# EAGLE design BMS Enerdel Adapter rev4 (EAGLE 9.6.2)
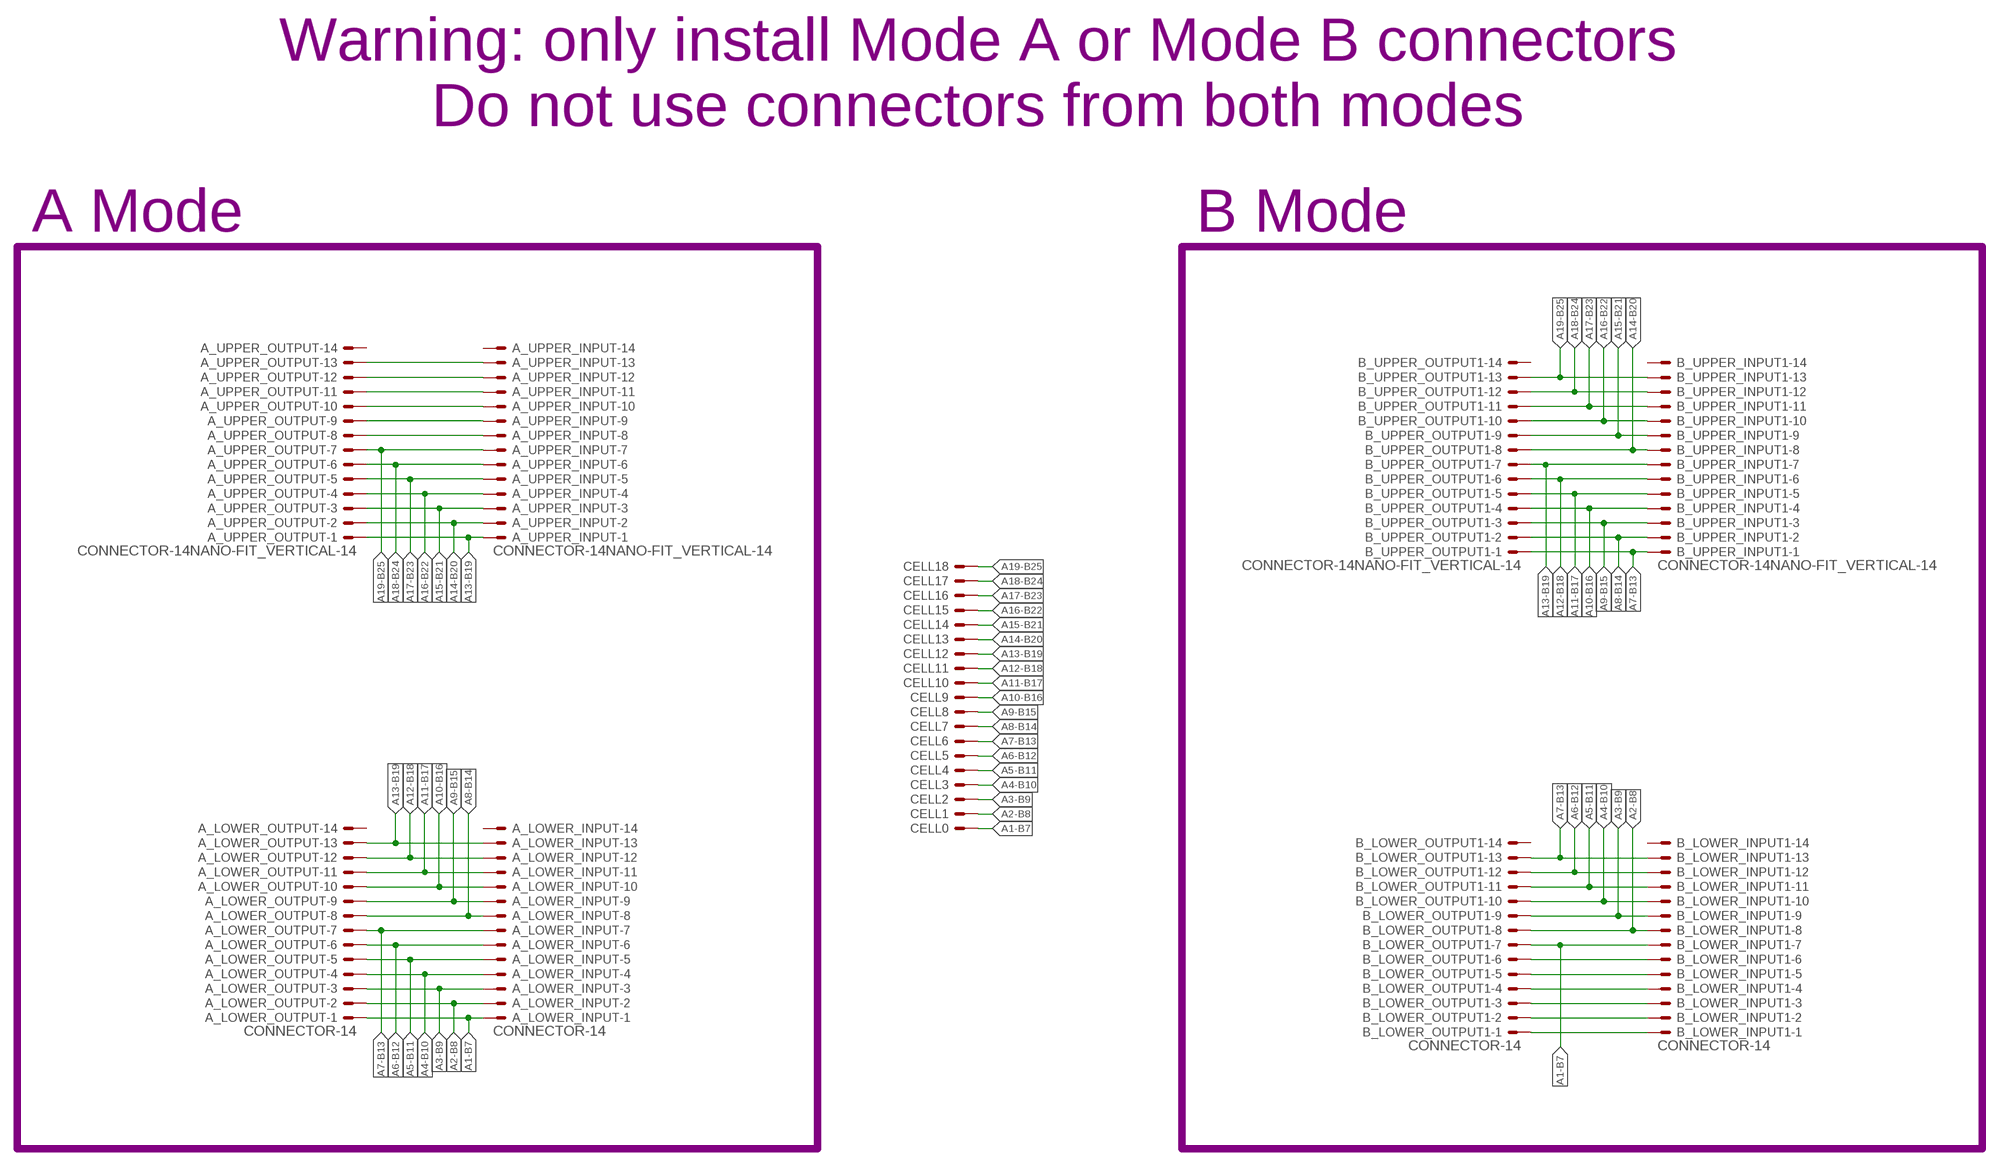
[diagram p0: schematic, sheet 1]

## Parts
A_LOWER_INPUT  CONNECTOR-14  [MINIFIT_5566-14]
A_LOWER_OUTPUT  CONNECTOR-14  [MINIFIT_5566-14]
A_UPPER_INPUT  CONNECTOR-14NANO-FIT_VERTICAL-14  [NANO-FIT_VERTICAL-14]
A_UPPER_OUTPUT  CONNECTOR-14NANO-FIT_VERTICAL-14  [NANO-FIT_VERTICAL-14]
B_LOWER_INPUT1  CONNECTOR-14  [MINIFIT_5566-14]
B_LOWER_OUTPUT1  CONNECTOR-14  [MINIFIT_5566-14]
B_UPPER_INPUT1  CONNECTOR-14NANO-FIT_VERTICAL-14  [NANO-FIT_VERTICAL-14]
B_UPPER_OUTPUT1  CONNECTOR-14NANO-FIT_VERTICAL-14  [NANO-FIT_VERTICAL-14]
CELL0  BATTERY_SPRING  [KEYSTONE5203]
CELL1  BATTERY_SPRING  [KEYSTONE5203]
CELL2  BATTERY_SPRING  [KEYSTONE5203]
CELL3  BATTERY_SPRING  [KEYSTONE5203]
CELL4  BATTERY_SPRING  [KEYSTONE5203]
CELL5  BATTERY_SPRING  [KEYSTONE5203]
CELL6  BATTERY_SPRING  [KEYSTONE5203]
CELL7  BATTERY_SPRING  [KEYSTONE5203]
CELL8  BATTERY_SPRING  [KEYSTONE5203]
CELL9  BATTERY_SPRING  [KEYSTONE5203]
CELL10  BATTERY_SPRING  [KEYSTONE5203]
CELL11  BATTERY_SPRING  [KEYSTONE5203]
CELL12  BATTERY_SPRING  [KEYSTONE5203]
CELL13  BATTERY_SPRING  [KEYSTONE5203]
CELL14  BATTERY_SPRING  [KEYSTONE5203]
CELL15  BATTERY_SPRING  [KEYSTONE5203]
CELL16  BATTERY_SPRING  [KEYSTONE5203]
CELL17  BATTERY_SPRING  [KEYSTONE5203]
CELL18  BATTERY_SPRING  [KEYSTONE5203]

## Nets
A1-B7: A_LOWER_INPUT.1 A_LOWER_OUTPUT.1 B_LOWER_INPUT1.7 B_LOWER_OUTPUT1.7 CELL0.P$1(S)
A2-B8: A_LOWER_INPUT.2 A_LOWER_OUTPUT.2 B_LOWER_INPUT1.8 B_LOWER_OUTPUT1.8 CELL1.P$1(S)
A3-B9: A_LOWER_INPUT.3 A_LOWER_OUTPUT.3 B_LOWER_INPUT1.9 B_LOWER_OUTPUT1.9 CELL2.P$1(S)
A4-B10: A_LOWER_INPUT.4 A_LOWER_OUTPUT.4 B_LOWER_INPUT1.10 B_LOWER_OUTPUT1.10 CELL3.P$1(S)
A5-B11: A_LOWER_INPUT.5 A_LOWER_OUTPUT.5 B_LOWER_INPUT1.11 B_LOWER_OUTPUT1.11 CELL4.P$1(S)
A6-B12: A_LOWER_INPUT.6 A_LOWER_OUTPUT.6 B_LOWER_INPUT1.12 B_LOWER_OUTPUT1.12 CELL5.P$1(S)
A7-B13: A_LOWER_INPUT.7 A_LOWER_OUTPUT.7 B_LOWER_INPUT1.13 B_LOWER_OUTPUT1.13 B_UPPER_INPUT1.P$1 B_UPPER_OUTPUT1.P$1 CELL6.P$1(S)
A8-B14: A_LOWER_INPUT.8 A_LOWER_OUTPUT.8 B_UPPER_INPUT1.P$2 B_UPPER_OUTPUT1.P$2 CELL7.P$1(S)
A9-B15: A_LOWER_INPUT.9 A_LOWER_OUTPUT.9 B_UPPER_INPUT1.P$3 B_UPPER_OUTPUT1.P$3 CELL8.P$1(S)
A10-B16: A_LOWER_INPUT.10 A_LOWER_OUTPUT.10 B_UPPER_INPUT1.P$4 B_UPPER_OUTPUT1.P$4 CELL9.P$1(S)
A11-B17: A_LOWER_INPUT.11 A_LOWER_OUTPUT.11 B_UPPER_INPUT1.P$5 B_UPPER_OUTPUT1.P$5 CELL10.P$1(S)
A12-B18: A_LOWER_INPUT.12 A_LOWER_OUTPUT.12 B_UPPER_INPUT1.P$6 B_UPPER_OUTPUT1.P$6 CELL11.P$1(S)
A13-B19: A_LOWER_INPUT.13 A_LOWER_OUTPUT.13 A_UPPER_INPUT.P$1 A_UPPER_OUTPUT.P$1 B_UPPER_INPUT1.P$7 B_UPPER_OUTPUT1.P$7 CELL12.P$1(S)
A14-B20: A_UPPER_INPUT.P$2 A_UPPER_OUTPUT.P$2 B_UPPER_INPUT1.P$8 B_UPPER_OUTPUT1.P$8 CELL13.P$1(S)
A15-B21: A_UPPER_INPUT.P$3 A_UPPER_OUTPUT.P$3 B_UPPER_INPUT1.P$9 B_UPPER_OUTPUT1.P$9 CELL14.P$1(S)
A16-B22: A_UPPER_INPUT.P$4 A_UPPER_OUTPUT.P$4 B_UPPER_INPUT1.P$10 B_UPPER_OUTPUT1.P$10 CELL15.P$1(S)
A17-B23: A_UPPER_INPUT.P$5 A_UPPER_OUTPUT.P$5 B_UPPER_INPUT1.P$11 B_UPPER_OUTPUT1.P$11 CELL16.P$1(S)
A18-B24: A_UPPER_INPUT.P$6 A_UPPER_OUTPUT.P$6 B_UPPER_INPUT1.P$12 B_UPPER_OUTPUT1.P$12 CELL17.P$1(S)
A19-B25: A_UPPER_INPUT.P$7 A_UPPER_OUTPUT.P$7 B_UPPER_INPUT1.P$13 B_UPPER_OUTPUT1.P$13 CELL18.P$1(S)
A-PASS1: A_UPPER_INPUT.P$8 A_UPPER_OUTPUT.P$8
A-PASS2: A_UPPER_INPUT.P$9 A_UPPER_OUTPUT.P$9
A-PASS3: A_UPPER_INPUT.P$10 A_UPPER_OUTPUT.P$10
A-PASS4: A_UPPER_INPUT.P$11 A_UPPER_OUTPUT.P$11
A-PASS5: A_UPPER_INPUT.P$12 A_UPPER_OUTPUT.P$12
A-PASS6: A_UPPER_INPUT.P$13 A_UPPER_OUTPUT.P$13
B-PASS1: B_LOWER_INPUT1.1 B_LOWER_OUTPUT1.1
B-PASS2: B_LOWER_INPUT1.2 B_LOWER_OUTPUT1.2
B-PASS3: B_LOWER_INPUT1.3 B_LOWER_OUTPUT1.3
B-PASS4: B_LOWER_INPUT1.4 B_LOWER_OUTPUT1.4
B-PASS5: B_LOWER_INPUT1.5 B_LOWER_OUTPUT1.5
B-PASS6: B_LOWER_INPUT1.6 B_LOWER_OUTPUT1.6
Unconnected: A_LOWER_INPUT.14 A_LOWER_OUTPUT.14 A_UPPER_INPUT.P$14 A_UPPER_OUTPUT.P$14 B_LOWER_INPUT1.14 B_LOWER_OUTPUT1.14 B_UPPER_INPUT1.P$14 B_UPPER_OUTPUT1.P$14

## Notes on the sheet
- Warning: only install Mode A or Mode B connectors
  Do not use connectors from both modes
- A Mode | B Mode

## Library data of the parts
A_LOWER_INPUT A_LOWER_OUTPUT A_UPPER_INPUT A_UPPER_OUTPUT B_LOWER_INPUT1 B_LOWER_OUTPUT1 B_UPPER_INPUT1 B_UPPER_OUTPUT1 = HyTechDevices:CONNECTOR-14: Mini-Fit Junior connector 14 pole Source: http://www.molex.com
CELL0 CELL1-CELL18 = HyTechDevices:BATTERY_SPRING: Keystone Electronics Battery Spring Contact Datasheet <http://keyelco.com/userAssets/file/M65p17.pdf>

## Module DRAIN+FILTER
Ports: CELL+(in) CELL-(out) S(N)(in) C(N)(out) V-(pwr)
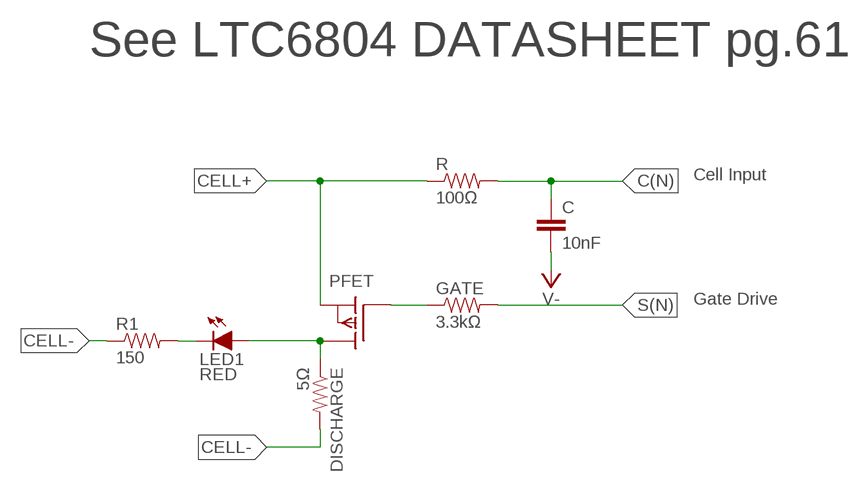
[diagram p1: schematic, module DRAIN+FILTER, sheet 1]

### Parts
C  10nF  CAP0805  [0805]
DISCHARGE  5Ω  RESISTORPWR163  [PWR163]
GATE  3.3kΩ  RESISTOR0805-RES  [0805]
LED1  RED  LED-0805  [LED-805]
PFET  P-CHANNEL_MOSFET_DMP3099L-7  [SOT23]
R  100Ω  RESISTOR0805-RES  [0805]
R1  150  RESISTOR0805-RES  [0805]

### Nets
C(N): C.1 R.2
CELL+: PFET.2(S) R.1
CELL-: DISCHARGE.2 R1.1
GATE: GATE.1 PFET.1(G)
N$1: DISCHARGE.1 LED1.A PFET.3(D)
N$2: LED1.C R1.2
S(N): GATE.2
V-: C.2

### Notes on the sheet
- See LTC6804 DATASHEET pg.61
- Cell Input
- Gate Drive

### Library data of the parts
C = HyTechDevices:CAP: Capacitor Standard 0603 ceramic capacitor, and 0.1" leaded capacitor.
DISCHARGE GATE R R1 = HyTechDevices:RESISTOR: Resistor Basic schematic elements and footprints for 0603, 1206, and PTH resistors.
LED1 = HyTechDevices:LED: Light Emitting Diode (LED) Source: Dangerous Prototypes Eagle Library <https://github.com/DangerousPrototypes/Eagle_Part_Library>
PFET = HyTechDevices:P-CHANNEL_MOSFET_DMP3099L-7: Diodes Incorporated P-Channel Enhancement Mode MOSFET Datasheet <http://www.mouser.com/ds/2/115/DMP3099L-266220.pdf>

## Module THERM_FILTER
Ports: VREF(pwr) GPIO(out) THERM(nc) V-(pwr)
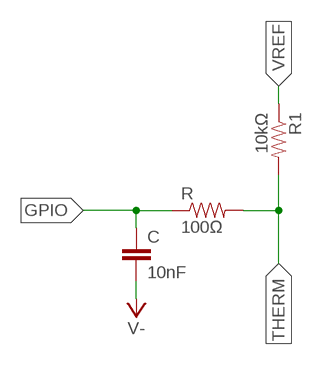
[diagram p2: schematic, module THERM_FILTER, sheet 1]

### Parts
C  10nF  CAP0805  [0805]
R  100Ω  RESISTOR0805-RES  [0805]
R1  10kΩ  RESISTOR0805-RES  [0805]

### Nets
GPIO: C.1 R.1
THERM: R1.2 R.2
V-: C.2
VREF: R1.1

### Library data of the parts
C = HyTechDevices:CAP: Capacitor Standard 0603 ceramic capacitor, and 0.1" leaded capacitor.
R R1 = HyTechDevices:RESISTOR: Resistor Basic schematic elements and footprints for 0603, 1206, and PTH resistors.

## Board
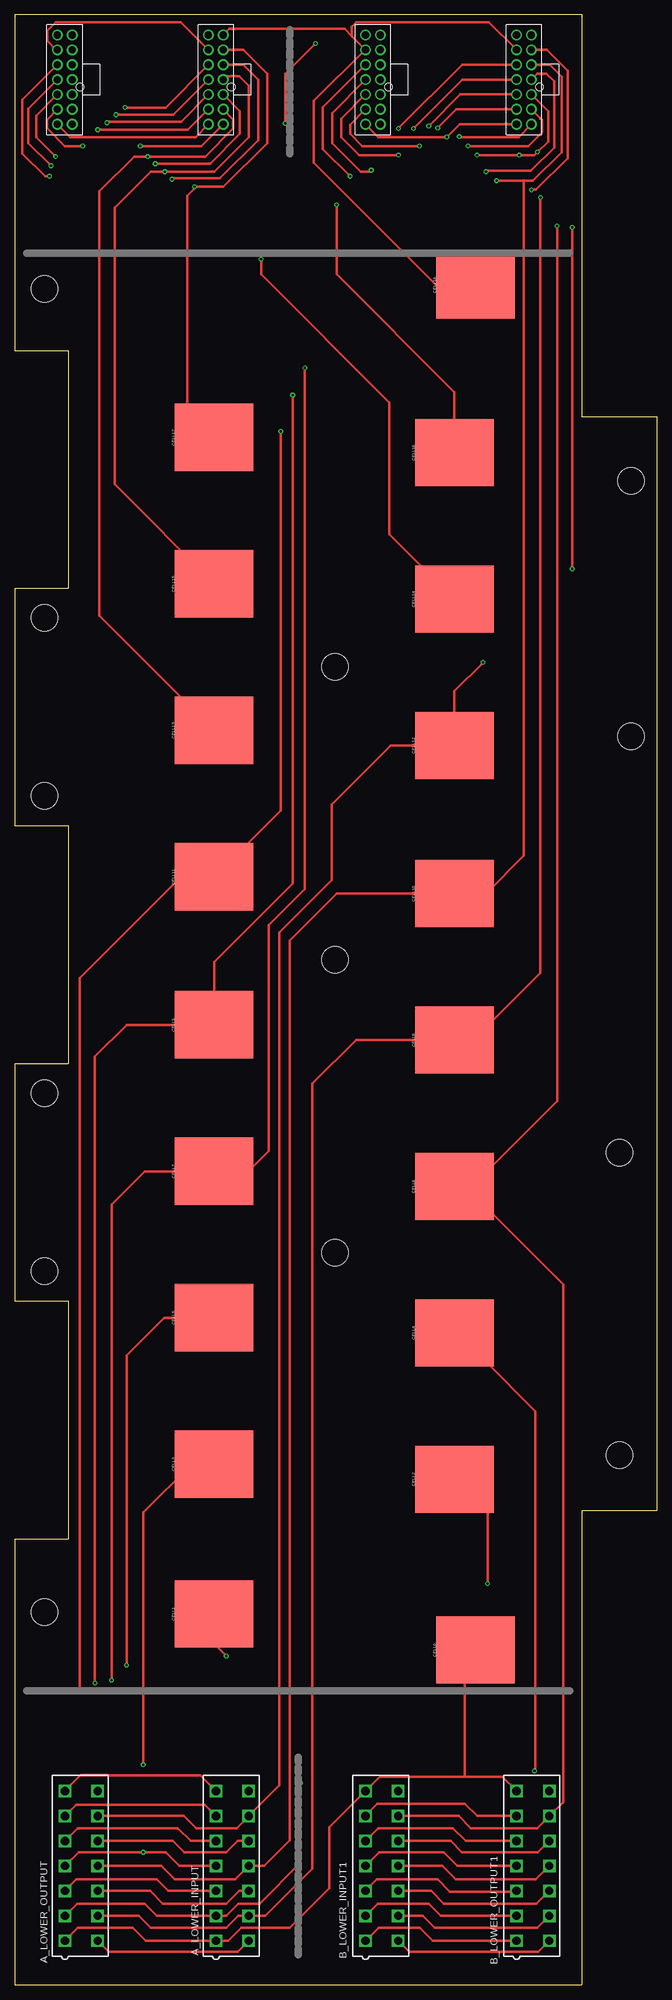
[diagram p3: board, top side]
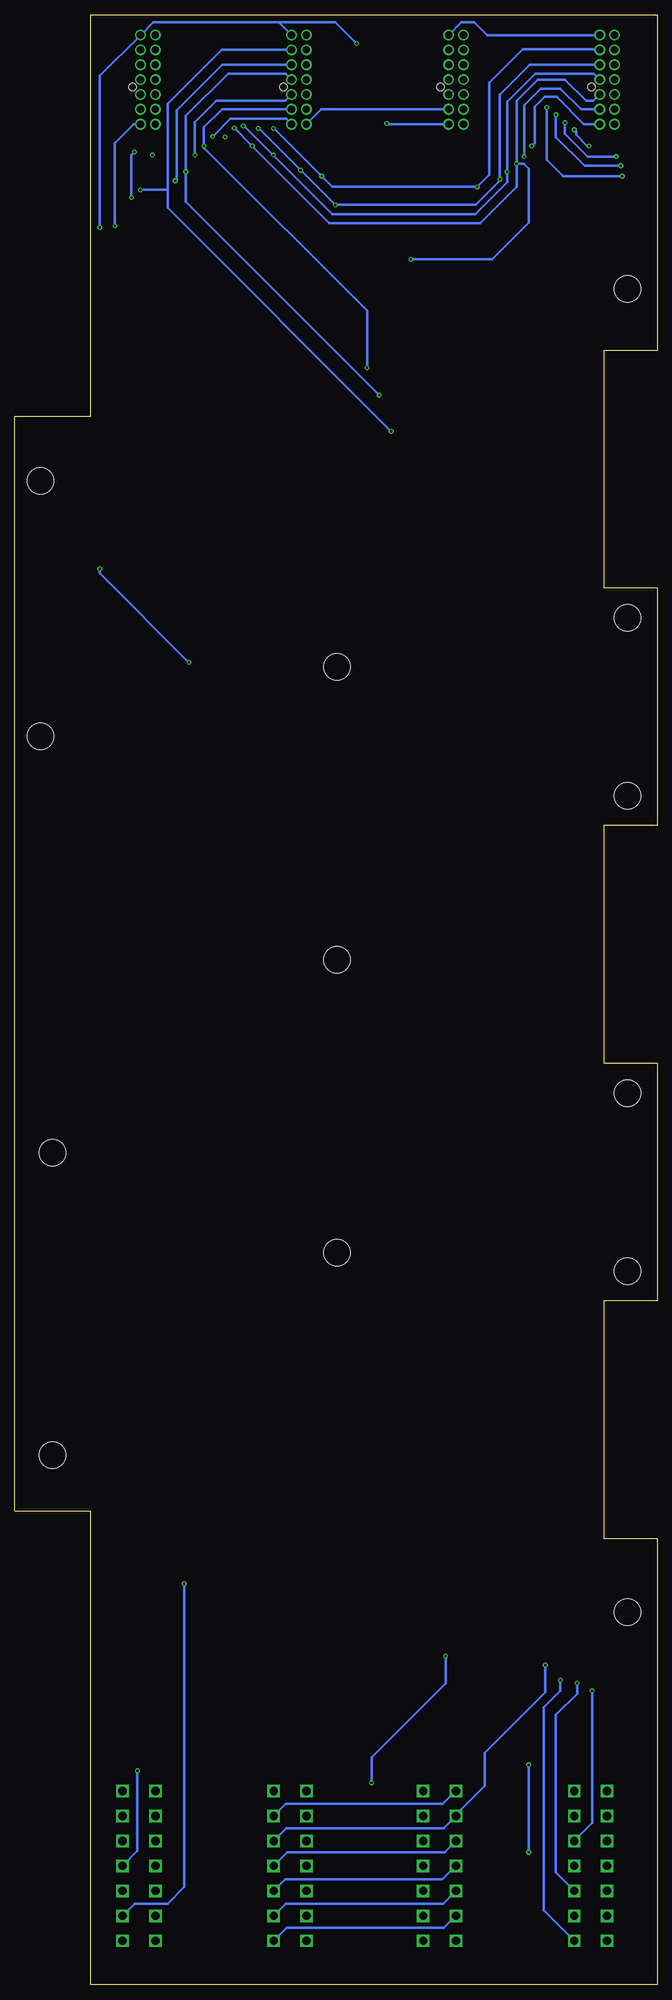
[diagram p4: board, bottom side, seen from below]

Size 108 x 331.35 mm. Coordinates in mm from the lower left corner, seen from the top.
Outline: 9,274.9 9,234.9 0,234.9 0,194.96 9,194.96 9,154.96 0,154.96 0,115.01 9,115.01 9,75.01 0,75.01 0,0 95.3,0 95.3,79.67 108,79.67 108,263.79 95.3,263.79 95.3,331.35 0,331.35 0,274.9 9,274.9
Copper layers (1*16): Top 0.035mm / dielectric 1.5mm / Bottom 0.035mm
Design rules "DRC Advanced Circuits *": minimum track width 6mil, minimum drill 15mil, track to track 24mil, track to pad 24mil, pad to pad 24mil, via to via 24mil, smd to smd 24mil, copper to edge 40mil, drill to drill 6mil, minimum pad ring 10mil, minimum via ring 8mil, stop-mask expansion 4mil, vias tented up to drill 0mil, thermal gap 10mil
Holes 4.5 mm at 5,285.25 5,229.9 5,199.95 5,149.95 5,120.01 5,62.63 101.65,89.08 101.65,139.95 103.65,209.95 103.65,252.96 53.85,221.66 53.85,172.38 53.85,123.1

### Footprints (pad centres in the part's own frame; a part is rotated, then mirrored left to right if it is on the bottom)
MINIFIT_5566-14 = drill 1.4 square: 1 12.6,-2.75; 2 8.4,-2.75; 3 4.2,-2.75; 4 0,-2.75; 5 -4.2,-2.75; 6 -8.4,-2.75; 7 -12.6,-2.75; 8 12.6,2.75; 9 8.4,2.75; 10 4.2,2.75; 11 0,2.75; 12 -4.2,2.75; 13 -8.4,2.75; 14 -12.6,2.75
NANO-FIT_VERTICAL-14 = drill 1.2: P$1 -7.5,0; P$2 -5,0; P$3 -2.5,0; P$4 0,0; P$5 2.5,0; P$6 5,0; P$7 7.5,0; P$8 -7.5,2.5; P$9 -5,2.5; P$10 -2.5,2.5; P$11 0,2.5; P$12 2.5,2.5; P$13 5,2.5; P$14 7.5,2.5 | hole 1.3: -1.27,-1.34
KEYSTONE5222 = smd 11.303 x 13.208: P$1 0,0

### Placement (x,y rotation side)
A_LOWER_INPUT  36.58,19.98 270 top
A_LOWER_OUTPUT  11.18,19.98 270 top
A_UPPER_INPUT  35.05,320.46 90 top
A_UPPER_OUTPUT  9.65,320.46 90 top
B_LOWER_INPUT1  61.72,19.98 270 top
B_LOWER_OUTPUT1  87.12,19.98 270 top
B_UPPER_INPUT1  86.87,320.46 90 top
B_UPPER_OUTPUT1  61.47,320.46 90 top
CELL0  BATTERY_SPRING_KEYSTONE5222  [KEYSTONE5222]  77.47,56.3 270 top
CELL1  BATTERY_SPRING_KEYSTONE5222  [KEYSTONE5222]  33.53,62.4 270 top
CELL2  BATTERY_SPRING_KEYSTONE5222  [KEYSTONE5222]  73.91,85 270 top
CELL3  BATTERY_SPRING_KEYSTONE5222  [KEYSTONE5222]  33.53,87.54 270 top
CELL4  BATTERY_SPRING_KEYSTONE5222  [KEYSTONE5222]  73.91,109.64 270 top
CELL5  BATTERY_SPRING_KEYSTONE5222  [KEYSTONE5222]  33.53,112.18 270 top
CELL6  BATTERY_SPRING_KEYSTONE5222  [KEYSTONE5222]  73.91,134.28 270 top
CELL7  BATTERY_SPRING_KEYSTONE5222  [KEYSTONE5222]  33.53,136.82 270 top
CELL8  BATTERY_SPRING_KEYSTONE5222  [KEYSTONE5222]  73.91,158.92 270 top
CELL9  BATTERY_SPRING_KEYSTONE5222  [KEYSTONE5222]  33.53,161.46 270 top
CELL10  BATTERY_SPRING_KEYSTONE5222  [KEYSTONE5222]  73.91,183.56 270 top
CELL11  BATTERY_SPRING_KEYSTONE5222  [KEYSTONE5222]  33.53,186.35 270 top
CELL12  BATTERY_SPRING_KEYSTONE5222  [KEYSTONE5222]  73.91,208.45 270 top
CELL13  BATTERY_SPRING_KEYSTONE5222  [KEYSTONE5222]  33.53,210.99 270 top
CELL14  BATTERY_SPRING_KEYSTONE5222  [KEYSTONE5222]  73.91,233.09 270 top
CELL15  BATTERY_SPRING_KEYSTONE5222  [KEYSTONE5222]  33.53,235.63 270 top
CELL16  BATTERY_SPRING_KEYSTONE5222  [KEYSTONE5222]  73.91,257.72 270 top
CELL17  BATTERY_SPRING_KEYSTONE5222  [KEYSTONE5222]  33.53,260.26 270 top
CELL18  BATTERY_SPRING_KEYSTONE5222  [KEYSTONE5222]  77.47,285.92 270 top

### Tracks (layer width: path | path; a pad name or v marks a point on that pad's centre or on a via)
A1-B7
  Top 0.406: A_LOWER_OUTPUT.1 10.61,9.57 19.81,9.57 22,7.38 A_LOWER_INPUT.1 35.91,7.38 38.1,9.57 46.23,9.57 52.83,16.17 52.83,26.44 B_LOWER_INPUT1.7 61.36,34.97 75.64,34.97 | B_LOWER_OUTPUT1.7 81.99,34.97 75.64,34.97 | CELL0.P$1 75.64,55.98 75.64,34.97
A2-B8  (via drill 0.38)
  Top 0.406: A_LOWER_OUTPUT.2 10.48,13.63 21.84,13.63 23.89,11.58 A_LOWER_INPUT.2 35.54,11.58 37.59,13.63 41.15,13.63 48.01,20.49 v48.01,33.95 | B_LOWER_INPUT1.8 66.35,5.5 87.99,5.5 B_LOWER_OUTPUT1.8 | CELL1.P$1 33.53,57.32 v35.56,55.29
  Bottom 0.406: B_LOWER_INPUT1.8 62.29,9.57 35.84,9.57 A_LOWER_INPUT.2 | v35.56,55.29 35.56,50.71 48.01,38.27 v48.01,33.95
A3-B9  (via drill 0.38)
  Top 0.406: A_LOWER_OUTPUT.3 10.34,17.69 23.88,17.69 25.79,15.78 A_LOWER_INPUT.3 | B_LOWER_INPUT1.9 68.6,11.58 70.61,9.57 87.86,9.57 B_LOWER_OUTPUT1.9 | v79.5,67.48 79.5,80.36 CELL2.P$1
  Bottom 0.406: B_LOWER_INPUT1.9 62.42,13.63 35.98,13.63 A_LOWER_INPUT.3 | B_LOWER_OUTPUT1.9 87.82,13.63 82.3,13.63 79.5,16.42 v79.5,67.48
A4-B10  (via drill 0.38)
  Top 0.406: A_LOWER_OUTPUT.4 10.71,22.27 v21.59,22.27 25.4,22.27 27.69,19.98 A_LOWER_INPUT.4 | B_LOWER_INPUT1.10 69.99,15.78 72.14,13.63 87.72,13.63 B_LOWER_OUTPUT1.10 | v21.59,37 21.59,79.42 29.72,87.54 CELL3.P$1
  Bottom 0.406: B_LOWER_INPUT1.10 62.56,17.69 36.11,17.69 A_LOWER_INPUT.4 | v21.59,37 v21.59,22.27
A5-B11  (via drill 0.38)
  Top 0.406: A_LOWER_OUTPUT.5 10.58,26.33 27.43,26.33 29.58,24.18 A_LOWER_INPUT.5 | B_LOWER_INPUT1.11 71.88,19.98 74.17,17.69 87.59,17.69 B_LOWER_OUTPUT1.11 | v87.38,35.98 87.5,36.11 87.5,96.47 79,104.97 CELL4.P$1
  Bottom 0.406: B_LOWER_INPUT1.11 62.19,22.27 35.74,22.27 A_LOWER_INPUT.5 | v87.38,35.98 87.38,22.48 B_LOWER_OUTPUT1.11
A6-B12  (via drill 0.38)
  Top 0.406: A_LOWER_OUTPUT.6 10.29,30.24 31.96,30.24 A_LOWER_INPUT.6 | B_LOWER_INPUT1.12 73.27,24.18 75.18,22.27 87.96,22.27 B_LOWER_OUTPUT1.12 | v18.8,53.76 18.8,105.83 25.15,112.18 CELL5.P$1
  Bottom 0.406: B_LOWER_INPUT1.12 62.32,26.33 35.88,26.33 34.19,28.01 | 34.19,28.01 A_LOWER_INPUT.6 | 34.19,28.01 34.19,28.2 28.96,33.44 28.96,39.03 18.8,49.19 v18.8,53.76
A7-B13  (via drill 0.38)
  Top 0.406: A_LOWER_INPUT.7 31.21,35.19 11.04,35.19 A_LOWER_OUTPUT.7 | B_LOWER_INPUT1.13 74.66,28.38 76.71,26.33 87.82,26.33 B_LOWER_OUTPUT1.13 92.2,30.71 92.2,117.77 79,130.97 CELL6.P$1 79,136.44 91.19,148.63 v91.19,295.82 | B_UPPER_INPUT1.P$1 84.72,310.81 74.8,310.81 v74.74,310.87
  Bottom 0.406: B_LOWER_INPUT1.13 62.46,30.39 36.01,30.39 A_LOWER_INPUT.7 | B_UPPER_OUTPUT1.P$1 62.36,313.86 71.75,313.86 v74.74,310.87 | v91.19,295.82 91.19,309.79 88.02,312.96 B_UPPER_INPUT1.P$1
A8-B14  (via drill 0.38)
  Top 0.406: A_LOWER_OUTPUT.8 15.8,5.5 37.45,5.5 A_LOWER_INPUT.8 | B_UPPER_INPUT1.P$2 88.39,313.94 88.39,313.86 88.58,313.67 88.58,311.51 86.36,309.29 v76.2,309.29 | v16.26,51.22 16.26,131.23 21.84,136.82 CELL7.P$1 39.22,136.82 42.67,140.27 42.67,178.22 48.77,184.32 v48.77,271.95
  Bottom 0.406: A_LOWER_OUTPUT.8 19.05,12.5 19.05,46.65 16.26,49.44 v16.26,51.22 | B_UPPER_OUTPUT1.P$2 73.15,315.46 76.2,312.41 v76.2,309.29 76.2,309.03 48.77,281.6 v48.77,271.95
A9-B15  (via drill 0.38)
  Top 0.406: A_LOWER_OUTPUT.9 20.83,11.58 22.84,9.57 35.56,9.57 37.59,11.6 37.61,11.58 A_LOWER_INPUT.9 42.15,11.58 50.04,19.47 50.04,151.55 57.4,158.92 CELL8.P$1 77.12,158.92 88.39,170.19 v88.39,300.65 | B_UPPER_INPUT1.P$3 89.66,315.17 89.66,310.05 v87.88,308.27 87.38,307.76 v84.84,307.76 v77.72,307.76
  Bottom 0.406: v77.72,307.76 77.72,313.32 74.14,316.91 62.52,316.91 B_UPPER_OUTPUT1.P$3 | v88.39,300.65 88.39,307.76 v87.88,308.27
A10-B16  (via drill 0.38)
  Top 0.406: A_LOWER_OUTPUT.10 22.74,15.78 24.89,13.63 35.56,13.63 37.71,15.78 A_LOWER_INPUT.10 | v13.46,50.71 13.46,156.12 18.8,161.46 CELL9.P$1 33.53,172 46.74,185.21 v46.74,267.38 | B_UPPER_INPUT1.P$4 87.88,321.48 89.41,321.48 90.68,320.21 90.68,309.03 86.74,305.1 79.38,305.1 v79.25,304.97
  Bottom 0.406: A_LOWER_OUTPUT.10 17.02,18.87 17.02,45.38 13.46,48.94 v13.46,50.71 | v46.74,267.38 79.25,299.89 v79.25,304.97 79.25,314.37 72.14,321.48 62.45,321.48 61.47,320.5 B_UPPER_OUTPUT1.P$4
A11-B17  (via drill 0.38)
  Top 0.406: A_LOWER_OUTPUT.11 24.64,19.98 26.92,17.69 37.04,17.69 A_LOWER_INPUT.11 41.91,19.98 46.23,24.3 46.23,175.68 54.1,183.56 CELL10.P$1 79.25,183.56 85.6,189.91 85.6,303.44 | B_UPPER_INPUT1.P$5 89.96,322.96 91.95,320.97 91.95,308.27 87.12,303.44 85.6,303.44 | v81.03,303.44 85.6,303.44
  Bottom 0.406: B_UPPER_OUTPUT1.P$5 73.15,322.96 80.77,315.34 80.77,303.7 v81.03,303.44
A12-B18  (via drill 0.38)
  Top 0.406: A_LOWER_OUTPUT.12 26.53,24.18 28.45,22.27 35.56,22.27 37.47,24.18 A_LOWER_INPUT.12 | B_UPPER_INPUT1.P$6 89.49,325.46 92.96,321.99 92.96,307.25 87.63,301.92 v86.87,301.92 | v10.92,49.44 10.92,169.33 29,187.41 CELL11.P$1 44.7,197.53 v44.7,261.28
  Bottom 0.406: B_UPPER_OUTPUT1.P$6 73.23,325.46 82.3,316.4 82.3,301.92 | v86.87,301.92 82.3,301.92 | A_LOWER_OUTPUT.12 10.92,27.18 v10.92,49.44 | 82.3,301.92 82.3,298.87 v44.7,261.28
A13-B19  (via drill 0.38)
  Top 0.406: A_LOWER_OUTPUT.13 28.43,28.38 30.48,26.33 37.28,26.33 A_LOWER_INPUT.13 44.45,33.5 44.45,176.95 53.3,185.8 53.3,198.54 63.2,208.45 CELL12.P$1 73.91,217.59 v78.74,222.42 | v21.08,309.29 31.38,309.29 A_UPPER_INPUT.P$1 | v45.47,313.1 45.47,321.42 50.55,326.5 v50.55,326.56 | v93.73,295.57 v93.73,238.17
  Bottom 0.406: A_UPPER_OUTPUT.P$1 12.31,312.96 16.89,317.54 18.92,317.54 20.57,315.89 20.57,309.79 v21.08,309.29 | 63.62,330.11 B_UPPER_OUTPUT1.P$7 | 63.62,330.11 84.72,330.11 B_UPPER_INPUT1.P$7 93.73,321.1 v93.73,295.57 | 63.62,330.11 54.1,330.11 v50.55,326.56 | A_UPPER_INPUT.P$1 45.33,312.96 v45.47,313.1 | v78.74,222.42 93.73,237.4 v93.73,238.17
A14-B20  (via drill 0.38)
  Top 0.406: A_UPPER_INPUT.P$2 36.77,313.75 36.77,312.25 32.02,307.51 v22.35,307.51 20.07,307.51 14.22,301.67 14.22,230.29 CELL13.P$1 | B_UPPER_OUTPUT1.P$8 61.12,310.81 v72.64,310.81 74.8,312.96 B_UPPER_INPUT1.P$8
  Bottom 0.406: A_UPPER_OUTPUT.P$2 12.78,315.46 16.26,318.94 19.56,318.94 22.35,316.14 v22.35,307.51 | A_UPPER_INPUT.P$2 56.47,315.46 B_UPPER_OUTPUT1.P$8
A15-B21  (via drill 0.38)
  Top 0.406: v23.62,306.3 32.83,306.3 37.85,311.32 37.85,315.17 A_UPPER_INPUT.P$3 | B_UPPER_OUTPUT1.P$9 56.39,312.88 56.39,311.32 58.42,309.29 v68.07,309.29 | v71.12,312.33 74.25,315.46 B_UPPER_INPUT1.P$9 | v41.4,290.24 41.4,287.7 62.99,266.11 62.99,244.01 CELL14.P$1
  Bottom 0.406: v71.12,312.33 v68.07,309.29 55.12,296.33 29.72,296.33 23.62,302.43 v23.62,306.3 | v41.4,290.24 27.75,290.24 21.59,296.4 21.59,305.48 22.42,306.3 v23.62,306.3 | A_UPPER_OUTPUT.P$3 10.71,316.91 11.94,316.91 15.49,320.46 20.07,320.46 23.62,316.91 v23.62,306.3
A16-B22  (via drill 0.38)
  Top 0.406: B_UPPER_OUTPUT1.P$10 54.86,313.86 54.86,310.81 57.91,307.76 v64.52,307.76 | v69.6,312.65 74.91,317.96 B_UPPER_INPUT1.P$10 | A_UPPER_INPUT.P$4 35.62,321.03 35.62,321.06 37.76,321.06 39.37,319.45 39.37,310.81 33.53,304.97 v25.21,304.97 22.86,304.97 16.76,298.87 16.76,252.39 CELL15.P$1
  Bottom 0.406: v69.6,312.65 69.41,312.65 v64.52,307.76 54.61,297.86 30.55,297.86 25.21,303.2 v25.21,304.97 25.21,316.75 20.49,321.48 10.63,321.48 10.63,321.44 A_UPPER_OUTPUT.P$4
A17-B23  (via drill 0.38)
  Top 0.406: A_UPPER_INPUT.P$5 38.39,322.96 40.89,320.46 40.89,310.3 34.45,303.86 26.58,303.86 v26.42,303.7 | B_UPPER_OUTPUT1.P$11 53.34,314.83 53.34,309.79 58.17,304.97 59.69,304.97 v59.94,305.22 | v67.06,312.26 75.25,320.46 B_UPPER_INPUT1.P$11 | v54.1,299.38 54.1,287.71 73.91,267.9 CELL16.P$1
  Bottom 0.406: v67.06,312.26 66.99,312.26 v59.94,305.22 v54.1,299.38 30.48,299.38 26.42,303.44 v26.42,303.7 26.42,317.92 21.38,322.96 A_UPPER_OUTPUT.P$5
A18-B24  (via drill 0.38)
  Top 0.406: B_UPPER_OUTPUT1.P$12 51.82,315.81 51.82,308.78 v56.39,304.21 | v64.52,312.26 75.22,322.96 B_UPPER_INPUT1.P$12 | v30.23,302.43 30.48,302.43 | 30.48,302.43 35.05,302.43 42.42,309.79 42.42,321.48 38.43,325.46 A_UPPER_INPUT.P$6 | 30.48,302.43 29,300.95 29,264.79 CELL17.P$1
  Bottom 0.406: A_UPPER_OUTPUT.P$6 9.73,325.54 22.61,325.54 28.19,319.95 28.19,304.46 v30.23,302.43 54.61,302.43 v56.39,304.21 64.44,312.26 v64.52,312.26
A19-B25
  Top 0.406: B_UPPER_OUTPUT1.P$13 58.91,325.52 | 58.91,325.52 56.64,327.79 | 56.64,327.79 56.64,329.35 57.4,330.11 79.72,330.11 B_UPPER_INPUT1.P$13 | A_UPPER_INPUT.P$7 36.07,328.98 55.45,328.98 56.64,327.79 | 58.91,325.52 50.29,316.91 50.29,306.52 70.9,285.92 CELL18.P$1
  Bottom 0.406: A_UPPER_INPUT.P$7 32.9,330.11 30.73,330.11 28.58,327.96 A_UPPER_OUTPUT.P$7
A-PASS1
  Top 0.406: A_UPPER_INPUT.P$8 30.4,310.81 9.3,310.81 A_UPPER_OUTPUT.P$8
A-PASS2  (via drill 0.38)
  Top 0.406: A_UPPER_OUTPUT.P$9 5.33,313.64 5.33,312.33 8.38,309.29 v11.43,309.29 | A_UPPER_INPUT.P$9 29.11,312.02 v13.94,312.02
  Bottom 0.406: v11.43,309.29 11.75,309.29 13.62,311.16 13.62,311.7 v13.94,312.02
A-PASS3  (via drill 0.38)
  Top 0.406: A_UPPER_OUTPUT.P$10 3.56,314.37 3.56,310.81 v6.86,307.51 | A_UPPER_INPUT.P$10 27.94,313.35 15.62,313.35 v15.49,313.22
  Bottom 0.406: v15.49,313.22 15.49,311.32 11.68,307.51 v6.86,307.51
A-PASS4  (via drill 0.38)
  Top 0.406: A_UPPER_OUTPUT.P$11 2.29,315.6 2.29,309.79 v6.1,305.98 | A_UPPER_INPUT.P$11 26.65,314.56 v17.02,314.56
  Bottom 0.406: v17.02,314.56 17.02,310.81 12.19,305.98 v6.1,305.98
A-PASS5  (via drill 0.38)
  Top 0.406: A_UPPER_OUTPUT.P$12 1.27,317.08 1.27,308.02 5.08,304.21 v5.84,304.21 | A_UPPER_INPUT.P$12 25.35,315.76 v18.54,315.76
  Bottom 0.406: v18.54,315.76 18.54,307 15.75,304.21 v5.84,304.21
A-PASS6
  Top 0.406: A_UPPER_OUTPUT.P$13 7.04,325.36 5.44,326.96 5.44,328.67 6.86,330.09 6.86,330.11 27.9,330.11 A_UPPER_INPUT.P$13
B-PASS1
  Top 0.406: B_LOWER_INPUT1.1 61.16,9.57 68.07,9.57 70.26,7.38 B_LOWER_OUTPUT1.1
B-PASS2
  Top 0.406: B_LOWER_INPUT1.2 61.02,13.63 69.6,13.63 71.63,11.6 84.35,11.6 B_LOWER_OUTPUT1.2
B-PASS3
  Top 0.406: B_LOWER_INPUT1.3 60.89,17.69 71.12,17.69 73.15,15.66 84.25,15.66 B_LOWER_OUTPUT1.3
B-PASS4
  Top 0.406: B_LOWER_INPUT1.4 61.26,22.27 72.14,22.27 74.42,19.98 B_LOWER_OUTPUT1.4
B-PASS5
  Top 0.406: B_LOWER_INPUT1.5 61.12,26.33 73.66,26.33 75.81,24.18 B_LOWER_OUTPUT1.5
B-PASS6
  Top 0.406: B_LOWER_OUTPUT1.6 84.35,28.36 77.72,28.36 75.69,30.39 60.99,30.39 B_LOWER_INPUT1.6

### Text on the board
tDocu: Out | In | Out | In | Mode A | Mode B | DO NOT MIX A & B | DANGER HIGH VOLTAGE | BMS Enerdel Adapter 2019 rev4 | DANGER HIGH VOLTAGE | Warning: Only install Mode A or Mode B connectors / DO NOT MIX | Mode A | Mode B | Out | In | Out | In | DANGER HIGH VOLTAGE
bDocu: DANGER HIGH VOLTAGE | DANGER HIGH VOLTAGE